# Altium schematic sheet Top.SchDoc: Digital fMUX Mezzanine - TOP
size 817 x 513 mm; Engineer: M.Dobbs, McGill U.; Revision: 4; PageSetup: Record=PageOptions|CenterHorizontal=True|CenterVertical=True|PrintScale=0.52|XCorrection=1.00|YCorrection=1.00|PrintKind=0|BorderSize=5000000|LeftOffset=0|BottomOffset=0|Orientation=2|PaperLength=1000|PaperWidth=1000|Scale=100|PaperSource=15|PrintQuality=1200|MediaType=1|DitherType=10|PaperKind=11 x 17|PrintScaleMode=1
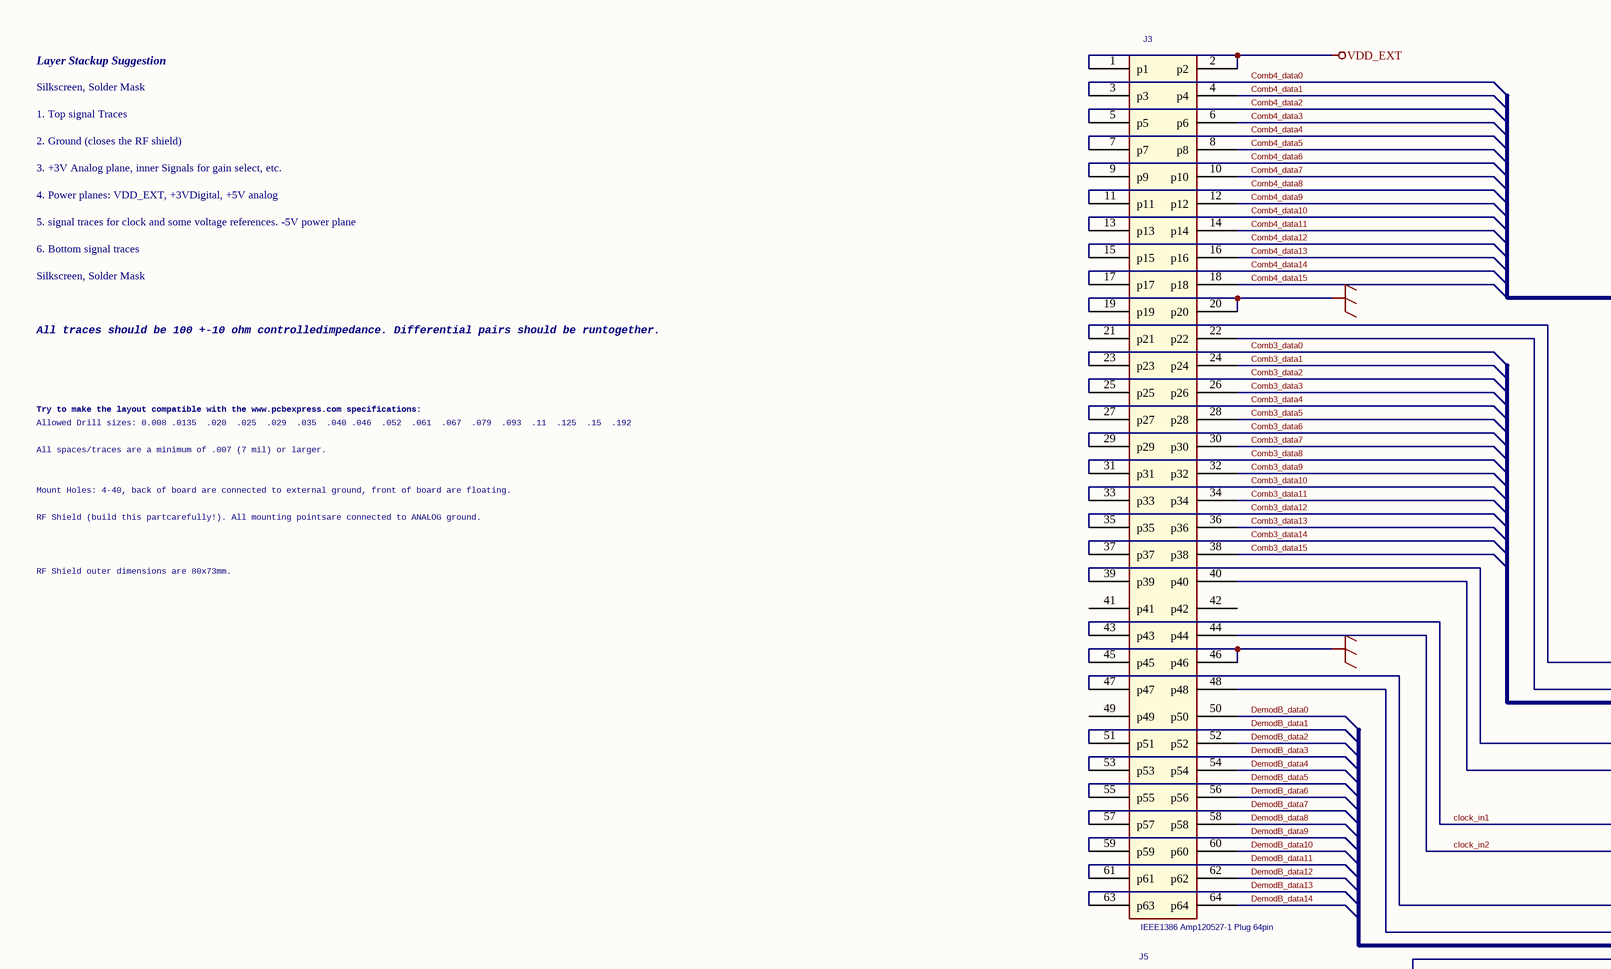
[diagram p0: Top.SchDoc, top left]
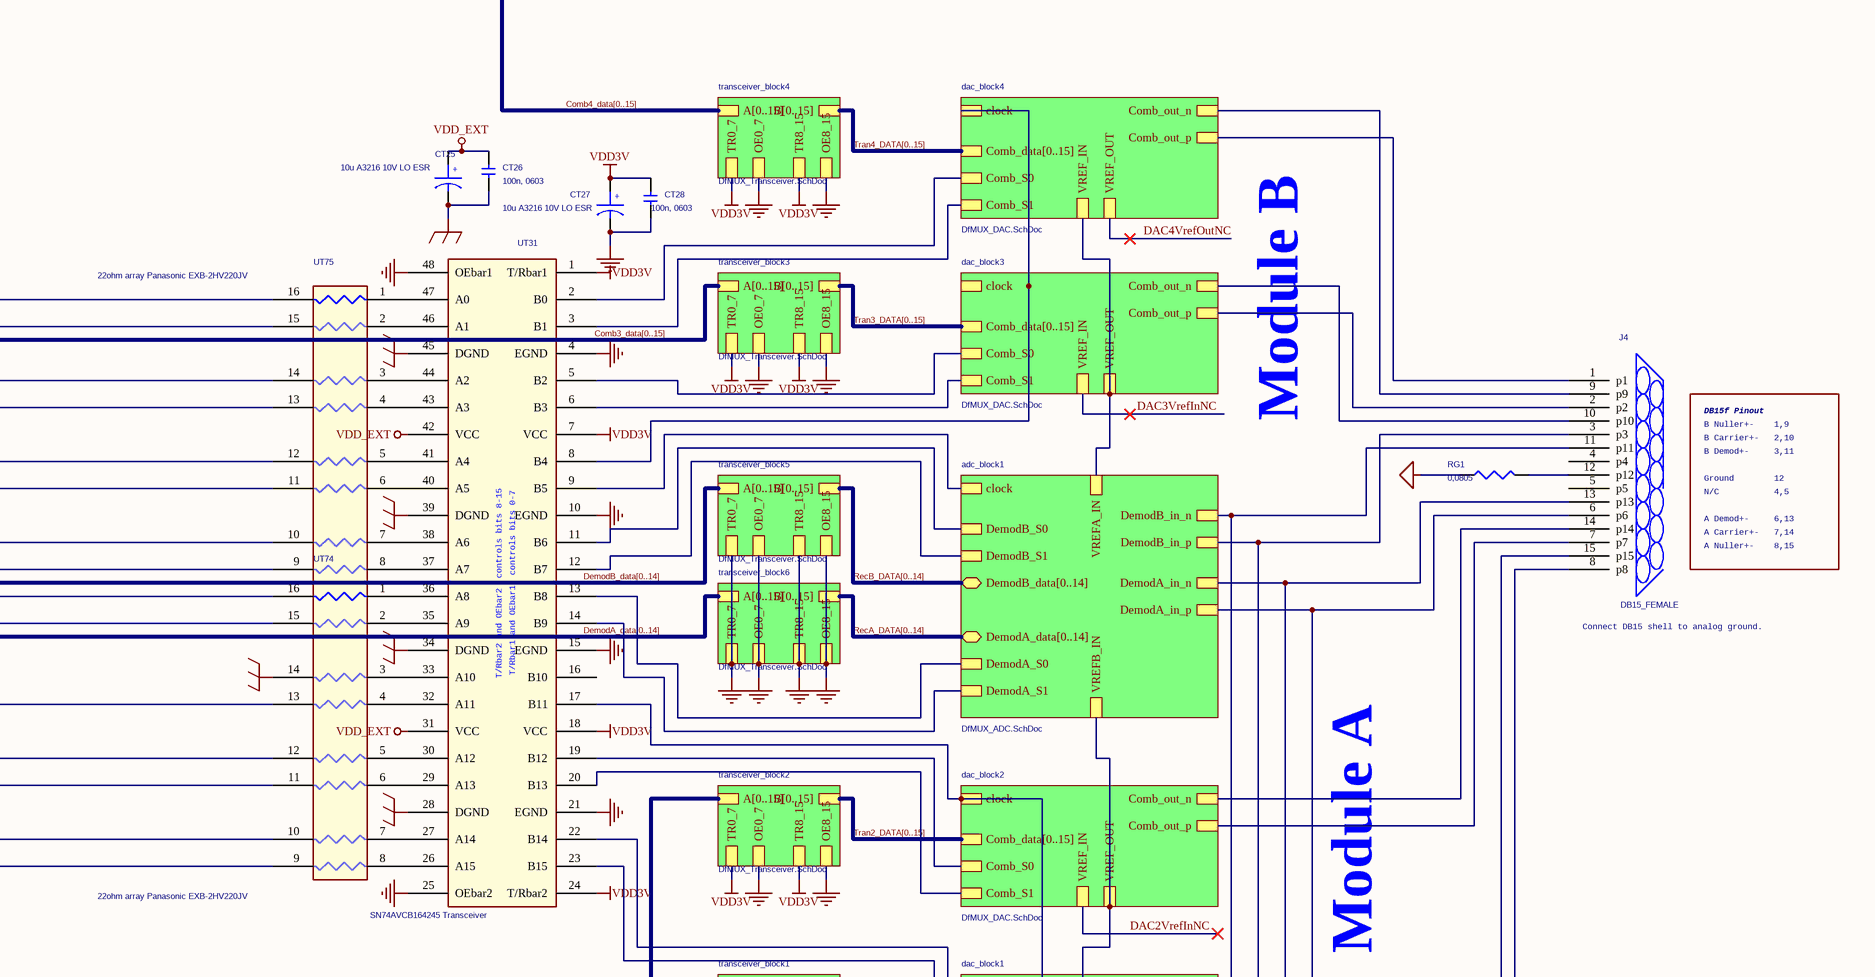
[diagram p1: Top.SchDoc, top right]
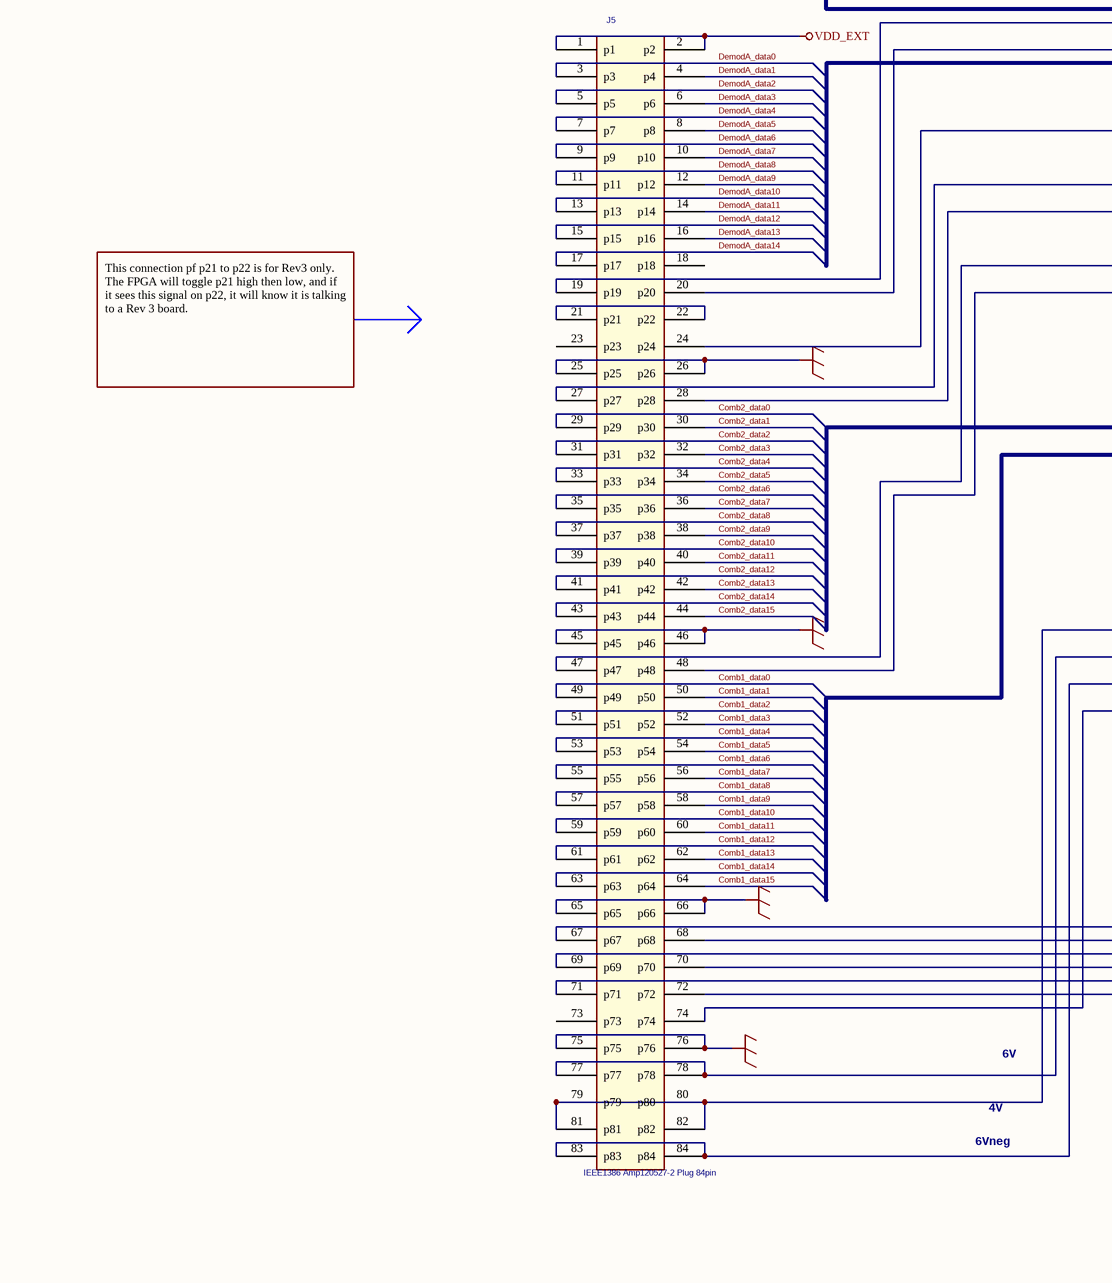
[diagram p2: Top.SchDoc, bottom left]
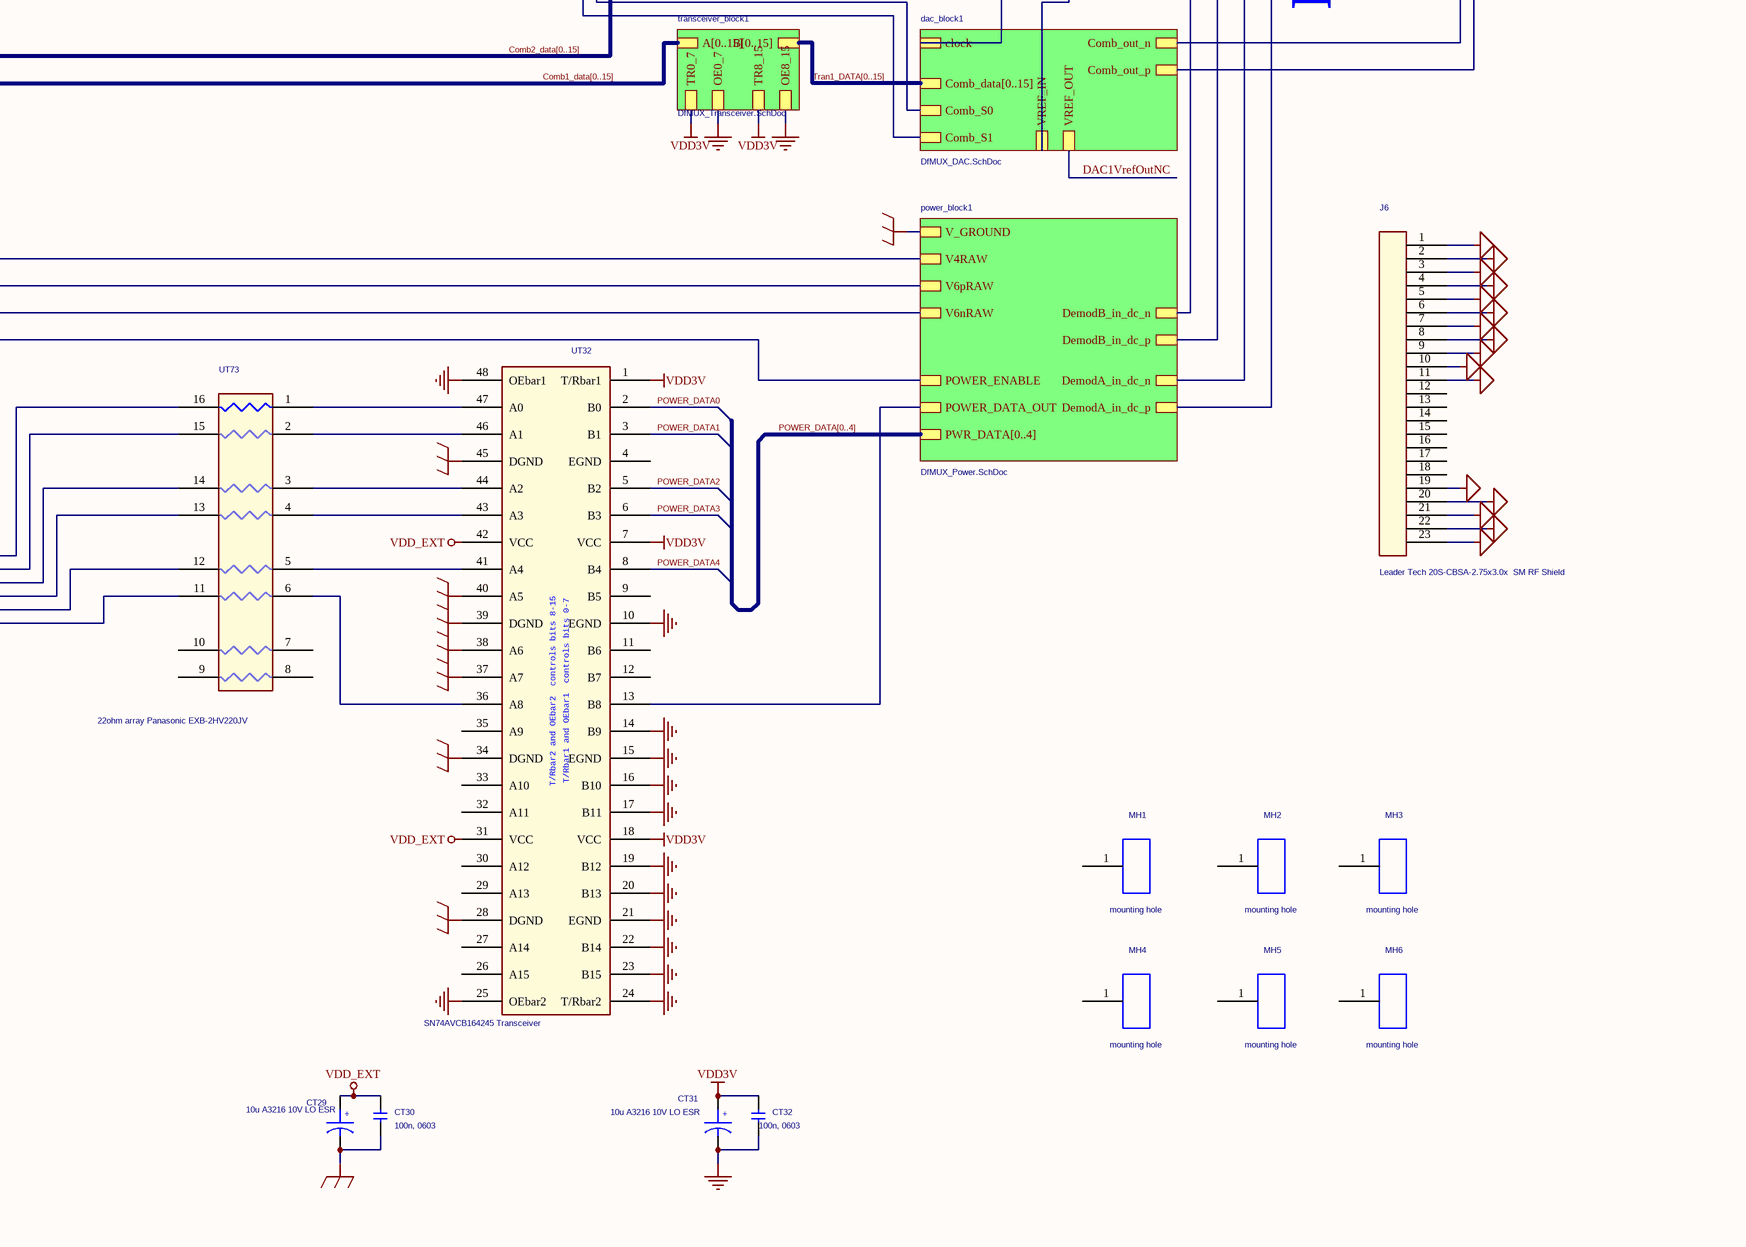
[diagram p3: Top.SchDoc, bottom right]

## Parts
CT25  10u A3216 10V LO ESR  [TANTA]
CT26  100n, 0603  [0603C]
CT27  10u A3216 10V LO ESR  [TANTA]
CT28  100n, 0603  [0603C]
CT29  10u A3216 10V LO ESR  [TANTA]
CT30  100n, 0603  [0603C]
CT31  10u A3216 10V LO ESR  [TANTA]
CT32  100n, 0603  [0603C]
J3  IEEE1386 Amp120527-1 Plug 64pin  [CON_AMP_1MM_64PINS]
J4  DB15_FEMALE  [DSUB/RS.318/TM/15]
J5  IEEE1386 Amp120527-2 Plug 84pin  [CON_AMP_1MM_84PINS]
J6  Leader Tech 20S-CBSA-2.75x3.0x  SM RF Shield  [SHIELD 2.75X3.00]
MH1  mounting hole  [MTHOLE.125]
MH2  mounting hole  [MTHOLE.125]
MH3  mounting hole  [MTHOLE.125]
MH4  mounting hole  [MTHOLE.125]
MH5  mounting hole  [MTHOLE.125]
MH6  mounting hole  [MTHOLE.125]
RG1  0,0805  [0805R]
UT31  SN74AVCB164245 Transceiver  [TSSOP48_.4MMPITCH_NARROW]
UT32  SN74AVCB164245 Transceiver  [TSSOP48_.4MMPITCH_NARROW]
UT73  22ohm array Panasonic EXB-2HV220JV  [RN8.150X63]
UT74  22ohm array Panasonic EXB-2HV220JV  [RN8.150X63]
UT75  22ohm array Panasonic EXB-2HV220JV  [RN8.150X63]

## Sub-sheets
adc_block1 = DfMUX_ADC.SchDoc: clock, DemodA_S0, DemodA_S1, DemodB_S0, DemodB_S1, DemodB_in_p, DemodB_in_n, DemodA_in_n, DemodA_in_p, VREFA_IN, VREFB_IN, DemodB_data[0..14], DemodA_data[0..14]
dac_block1 = DfMUX_DAC.SchDoc: Comb_data[0..15], Comb_S0, Comb_S1, Comb_out_p, Comb_out_n, clock, VREF_IN, VREF_OUT  | ReuseAnnotated: YES; Rd15_PartReference: RD17; Rd15_COMPLOC: [3002.633,445.433]; Rd30_PartReference: RD8; Rd30_COMPLOC: [3457.633,605.433]; Rd2set_PartReference: RD2SET1; Rd2set_COMPLOC: [2044.633,425.000]; Rd33_PartReference: RD15; Rd33_COMPLOC: [3002.633,500.433]; Cd9_PartReference: CD13; Cd9_COMPLOC: [2447.633,620.433]; Ld11_PartReference: LD1; Ld11_COMPLOC: [2202.633,700.433]; CD__PartReference: CD83; CD__COMPLOC: [3617.633,705.433]; Cd3_PartReference: CD9; Cd3_COMPLOC: [2087.633,640.433]; Rd36_PartReference: RD28; Rd36_COMPLOC: [2154.633,360.000]; Rd18_PartReference: RD4; Rd18_COMPLOC: [2947.633,610.433]; Rd38_PartReference: RD30; Rd38_COMPLOC: [2269.633,350.000]; Ud4_PartReference: UD3; Ud4_COMPLOC: [3517.633,435.433]; Rd29_PartReference: RD25; Rd29_COMPLOC: [3455.633,442.433]; Ud1_PartReference: UD1; Ud1_COMPLOC: [1689.033,701.833]; Ud3_PartReference: UD2; Ud3_COMPLOC: [3172.633,410.433]; Rd26_PartReference: RD7; Rd26_COMPLOC: [3102.633,555.433]; Cd14_PartReference: CD19; Cd14_COMPLOC: [2852.633,415.433]; Rd11_PartReference: RD16; Rd11_COMPLOC: [2392.633,565.433]; Cd10_PartReference: CD11; Cd10_COMPLOC: [2507.633,620.433]; Rd20_PartReference: RD2; Rd20_COMPLOC: [2947.633,665.433]; Jd1_PartReference: JD1; Jd1_COMPLOC: [2127.633,495.433]; Cd2_PartReference: CD8; Cd2_COMPLOC: [2032.633,640.433]; Rd13_PartReference: RD9; Rd13_COMPLOC: [2612.633,600.433]; Cd18_PartReference: CD5; Cd18_COMPLOC: [3402.633,605.433]; Rd24_PartReference: RD5; Rd24_COMPLOC: [3102.633,665.433]; Rd19_PartReference: RD22; Rd19_COMPLOC: [2947.633,390.433]; Cd8_PartReference: CD10; Cd8_COMPLOC: [2279.633,533.433]; Cd6_PartReference: CD3; Cd6_COMPLOC: [1877.633,700.433]; Cd__3_PartReference: CD92; Cd__3_COMPLOC: [3617.633,430.433]; Rd22_PartReference: RD21; Rd22_COMPLOC: [3047.633,445.433]; Rd34_PartReference: RD1; Rd34_COMPLOC: [3342.633,720.433]; Cd16_PartReference: CD1; Cd16_COMPLOC: [2732.633,700.433]; Rd35_PartReference: RD29; Rd35_COMPLOC: [3294.633,350.000]; Cd7_PartReference: CD4; Cd7_COMPLOC: [1797.633,635.367]; Cd4_PartReference: CD14; Cd4_COMPLOC: [1747.633,460.433]; Rd14_PartReference: RD19; Rd14_COMPLOC: [2612.633,505.433]; Rd32_PartReference: RD13; Rd32_COMPLOC: [3722.633,600.000]; Cd15_PartReference: CD2; Cd15_COMPLOC: [2532.633,700.433]; Rd31_PartReference: RD18; Rd31_COMPROT: 0; Rd31_COMPLOC: [3722.633,534.367]; Ld14_PartReference: LD4; Ld14_COMPLOC: [2467.633,505.433]; Rd21_PartReference: RD23; Rd21_COMPLOC: [3047.633,390.433]; Rd37_PartReference: RD20; Rd37_COMPLOC: [2151.633,417.000]; Ld12_PartReference: LD3; Ld12_COMPLOC: [2337.633,425.433]; Rd12_PartReference: RD14; Rd12_COMPLOC: [2567.633,620.433]; Rd33_1_PartReference: RD11; Rd33_1_COMPLOC: [2392.633,620.433]; Rd28_PartReference: RD3; Rd28_COMPLOC: [3402.633,660.433]; Rd27_PartReference: RD27; Rd27_COMPLOC: [3397.633,390.433]; Rd23_PartReference: RD24; Rd23_COMPLOC: [3046.633,500.433]; Ld13_PartReference: LD2; Ld13_COMPLOC: [2372.633,700.433]; Cd19_PartReference: CD6; Cd19_COMPLOC: [3159.633,720.000]; CD__1_PartReference: CD84; CD__1_COMPLOC: [3657.633,360.433]; Cd1_PartReference: CD17; Cd1_COMPLOC: [2057.633,378.000]; Rd16_PartReference: RD26; Rd16_COMPLOC: [2732.633,355.433]; Rd25_PartReference: RD6; Rd25_COMPLOC: [3102.633,610.433]; Rd17_PartReference: RD12; Rd17_COMPLOC: [2947.633,555.433]; Cd5_PartReference: CD15; Cd5_COMPLOC: [1892.633,530.433]; Cd13_PartReference: CD20; Cd13_COMPLOC: [2847.633,355.433]; Rd10_PartReference: RD10; Rd10_COMPLOC: [2337.633,510.433]; Ud2_PartReference: UD4; Ud2_COMPLOC: [2877.633,625.433]; Cd__2_PartReference: CD91; Cd__2_COMPLOC: [3454.633,650.000]; Cd17_PartReference: CD18; Cd17_COMPLOC: [3397.633,440.433]; TitleBlock_2_Page_Number: 4
dac_block2 = DfMUX_DAC.SchDoc: Comb_data[0..15], Comb_S0, Comb_S1, Comb_out_p, Comb_out_n, clock, VREF_IN, VREF_OUT  | ReuseAnnotated: YES; Rd15_PartReference: RD47; Rd15_COMPLOC: [3002.633,891.433]; Rd30_PartReference: RD38; Rd30_COMPLOC: [3457.633,1051.433]; Rd2set_PartReference: RD2SET2; Rd2set_COMPLOC: [2055.633,875.000]; Rd33_PartReference: RD45; Rd33_COMPLOC: [3002.633,946.433]; Cd9_PartReference: CD33; Cd9_COMPLOC: [2447.633,1066.433]; Ld11_PartReference: LD5; Ld11_COMPLOC: [2224.633,1140.000]; CD__PartReference: CD85; CD__COMPLOC: [3617.633,1151.433]; Cd3_PartReference: CD29; Cd3_COMPLOC: [2087.633,1086.433]; Rd36_PartReference: RD58; Rd36_COMPLOC: [2157.633,820.000]; Rd18_PartReference: RD34; Rd18_COMPLOC: [2947.633,1056.433]; Rd38_PartReference: RD60; Rd38_COMPLOC: [2292.633,806.433]; Ud4_PartReference: UD7; Ud4_COMPLOC: [3517.633,881.433]; Rd29_PartReference: RD55; Rd29_COMPLOC: [3455.633,888.433]; Ud1_PartReference: UD5; Ud1_COMPLOC: [1689.033,1147.833]; Ud3_PartReference: UD6; Ud3_COMPLOC: [3172.633,856.433]; Rd26_PartReference: RD37; Rd26_COMPLOC: [3102.633,1001.433]; Cd14_PartReference: CD39; Cd14_COMPLOC: [2852.633,861.433]; Rd11_PartReference: RD46; Rd11_COMPLOC: [2392.633,1011.433]; Cd10_PartReference: CD31; Cd10_COMPLOC: [2507.633,1066.433]; Rd20_PartReference: RD32; Rd20_COMPLOC: [2947.633,1111.433]; Jd1_PartReference: JD2; Jd1_COMPLOC: [2127.633,941.433]; Cd2_PartReference: CD28; Cd2_COMPLOC: [2032.633,1086.433]; Rd13_PartReference: RD39; Rd13_COMPLOC: [2612.633,1046.433]; Cd18_PartReference: CD25; Cd18_COMPLOC: [3402.633,1051.433]; Rd24_PartReference: RD35; Rd24_COMPLOC: [3102.633,1111.433]; Rd19_PartReference: RD52; Rd19_COMPLOC: [2947.633,836.433]; Cd8_PartReference: CD30; Cd8_COMPLOC: [2279.633,979.433]; Cd6_PartReference: CD23; Cd6_COMPLOC: [1877.633,1146.433]; Cd__3_PartReference: CD94; Cd__3_COMPLOC: [3617.633,876.433]; Rd22_PartReference: RD51; Rd22_COMPLOC: [3047.633,891.433]; Rd34_PartReference: RD31; Rd34_COMPLOC: [3342.633,1166.433]; Cd16_PartReference: CD21; Cd16_COMPLOC: [2732.633,1146.433]; Rd35_PartReference: RD59; Rd35_COMPLOC: [3292.633,796.433]; Cd7_PartReference: CD24; Cd7_COMPLOC: [1799.633,1080.000]; Cd4_PartReference: CD34; Cd4_COMPLOC: [1747.633,906.433]; Rd14_PartReference: RD49; Rd14_COMPLOC: [2612.633,951.433]; Rd32_PartReference: RD43; Rd32_COMPLOC: [3719.633,1036.367]; Cd15_PartReference: CD22; Cd15_COMPLOC: [2532.633,1146.433]; Rd31_PartReference: RD48; Rd31_COMPROT: 0; Rd31_COMPLOC: [3719.633,982.367]; Ld14_PartReference: LD8; Ld14_COMPLOC: [2467.633,951.433]; Rd21_PartReference: RD53; Rd21_COMPLOC: [3047.633,836.433]; Rd37_PartReference: RD50; Rd37_COMPLOC: [2158.633,875.000]; Ld12_PartReference: LD7; Ld12_COMPLOC: [2337.633,871.433]; Rd12_PartReference: RD44; Rd12_COMPLOC: [2567.633,1066.433]; Rd33_1_PartReference: RD41; Rd33_1_COMPLOC: [2392.633,1066.433]; Rd28_PartReference: RD33; Rd28_COMPLOC: [3402.633,1106.433]; Rd27_PartReference: RD57; Rd27_COMPLOC: [3397.633,836.433]; Rd23_PartReference: RD54; Rd23_COMPLOC: [3046.633,946.433]; Ld13_PartReference: LD6; Ld13_COMPLOC: [2369.633,1140.000]; Cd19_PartReference: CD26; Cd19_COMPLOC: [3159.633,1165.000]; CD__1_PartReference: CD86; CD__1_COMPLOC: [3657.633,806.433]; Cd1_PartReference: CD37; Cd1_COMPLOC: [2054.633,820.000]; Rd16_PartReference: RD56; Rd16_COMPLOC: [2732.633,801.433]; Rd25_PartReference: RD36; Rd25_COMPLOC: [3102.633,1056.433]; Rd17_PartReference: RD42; Rd17_COMPLOC: [2947.633,1001.433]; Cd5_PartReference: CD35; Cd5_COMPLOC: [1892.633,976.433]; Cd13_PartReference: CD40; Cd13_COMPLOC: [2847.633,801.433]; Rd10_PartReference: RD40; Rd10_COMPLOC: [2337.633,956.433]; Ud2_PartReference: UD8; Ud2_COMPLOC: [2874.633,1070.000]; Cd__2_PartReference: CD93; Cd__2_COMPLOC: [3454.633,1095.000]; Cd17_PartReference: CD38; Cd17_COMPLOC: [3397.633,886.433]; TitleBlock_2_Page_Number: 5
dac_block3 = DfMUX_DAC.SchDoc: Comb_data[0..15], Comb_S0, Comb_S1, Comb_out_p, Comb_out_n, clock, VREF_IN, VREF_OUT  | ReuseAnnotated: YES; Rd15_PartReference: RD77; Rd15_COMPLOC: [3007.633,2511.433]; Rd30_PartReference: RD68; Rd30_COMPLOC: [3462.633,2671.433]; Rd2set_PartReference: RD2SET3; Rd2set_COMPLOC: [2054.633,2493.000]; Rd33_PartReference: RD75; Rd33_COMPLOC: [3007.633,2566.433]; Cd9_PartReference: CD53; Cd9_COMPLOC: [2452.633,2686.433]; Ld11_PartReference: LD9; Ld11_COMPLOC: [2207.633,2766.433]; CD__PartReference: CD87; CD__COMPLOC: [3622.633,2771.433]; Cd3_PartReference: CD49; Cd3_COMPLOC: [2092.633,2706.433]; Rd36_PartReference: RD88; Rd36_COMPLOC: [2157.633,2434.000]; Rd18_PartReference: RD64; Rd18_COMPLOC: [2952.633,2676.433]; Rd38_PartReference: RD90; Rd38_COMPLOC: [2297.633,2426.433]; Ud4_PartReference: UD11; Ud4_COMPLOC: [3522.633,2501.433]; Rd29_PartReference: RD85; Rd29_COMPLOC: [3460.633,2508.433]; Ud1_PartReference: UD9; Ud1_COMPLOC: [1694.033,2767.833]; Ud3_PartReference: UD10; Ud3_COMPLOC: [3177.633,2476.433]; Rd26_PartReference: RD67; Rd26_COMPLOC: [3107.633,2621.433]; Cd14_PartReference: CD59; Cd14_COMPLOC: [2857.633,2481.433]; Rd11_PartReference: RD76; Rd11_COMPLOC: [2397.633,2631.433]; Cd10_PartReference: CD51; Cd10_COMPLOC: [2512.633,2686.433]; Rd20_PartReference: RD62; Rd20_COMPLOC: [2952.633,2731.433]; Jd1_PartReference: JD3; Jd1_COMPLOC: [2132.633,2561.433]; Cd2_PartReference: CD48; Cd2_COMPLOC: [2037.633,2706.433]; Rd13_PartReference: RD69; Rd13_COMPLOC: [2617.633,2666.433]; Cd18_PartReference: CD45; Cd18_COMPLOC: [3407.633,2671.433]; Rd24_PartReference: RD65; Rd24_COMPLOC: [3107.633,2731.433]; Rd19_PartReference: RD82; Rd19_COMPLOC: [2952.633,2456.433]; Cd8_PartReference: CD50; Cd8_COMPLOC: [2284.633,2599.433]; Cd6_PartReference: CD43; Cd6_COMPLOC: [1882.633,2766.433]; Cd__3_PartReference: CD96; Cd__3_COMPLOC: [3622.633,2496.433]; Rd22_PartReference: RD81; Rd22_COMPLOC: [3052.633,2511.433]; Rd34_PartReference: RD61; Rd34_COMPLOC: [3347.633,2786.433]; Cd16_PartReference: CD41; Cd16_COMPLOC: [2737.633,2766.433]; Rd35_PartReference: RD89; Rd35_COMPLOC: [3294.633,2415.000]; Cd7_PartReference: CD44; Cd7_COMPLOC: [1804.633,2700.000]; Cd4_PartReference: CD54; Cd4_COMPLOC: [1752.633,2526.433]; Rd14_PartReference: RD79; Rd14_COMPLOC: [2617.633,2571.433]; Rd32_PartReference: RD73; Rd32_COMPLOC: [3725.633,2662.000]; Cd15_PartReference: CD42; Cd15_COMPLOC: [2537.633,2766.433]; Rd31_PartReference: RD78; Rd31_COMPROT: 90; Rd31_COMPLOC: [3727.633,2471.433]; Ld14_PartReference: LD12; Ld14_COMPLOC: [2472.633,2571.433]; Rd21_PartReference: RD83; Rd21_COMPLOC: [3052.633,2456.433]; Rd37_PartReference: RD80; Rd37_COMPLOC: [2157.633,2493.000]; Ld12_PartReference: LD11; Ld12_COMPLOC: [2342.633,2491.433]; Rd12_PartReference: RD74; Rd12_COMPLOC: [2572.633,2686.433]; Rd33_1_PartReference: RD71; Rd33_1_COMPLOC: [2397.633,2686.433]; Rd28_PartReference: RD63; Rd28_COMPLOC: [3407.633,2726.433]; Rd27_PartReference: RD87; Rd27_COMPLOC: [3402.633,2456.433]; Rd23_PartReference: RD84; Rd23_COMPLOC: [3051.633,2566.433]; Ld13_PartReference: LD10; Ld13_COMPLOC: [2377.633,2766.433]; Cd19_PartReference: CD46; Cd19_COMPLOC: [3164.633,2785.000]; CD__1_PartReference: CD88; CD__1_COMPLOC: [3662.633,2426.433]; Cd1_PartReference: CD57; Cd1_COMPLOC: [2054.633,2435.000]; Rd16_PartReference: RD86; Rd16_COMPLOC: [2737.633,2421.433]; Rd25_PartReference: RD66; Rd25_COMPLOC: [3107.633,2676.433]; Rd17_PartReference: RD72; Rd17_COMPLOC: [2952.633,2621.433]; Cd5_PartReference: CD55; Cd5_COMPLOC: [1897.633,2596.433]; Cd13_PartReference: CD60; Cd13_COMPLOC: [2852.633,2421.433]; Rd10_PartReference: RD70; Rd10_COMPLOC: [2342.633,2576.433]; Ud2_PartReference: UD12; Ud2_COMPLOC: [2879.633,2690.000]; Cd__2_PartReference: CD95; Cd__2_COMPLOC: [3459.633,2715.000]; Cd17_PartReference: CD58; Cd17_COMPLOC: [3402.633,2506.433]; TitleBlock_2_Page_Number: 6
dac_block4 = DfMUX_DAC.SchDoc: Comb_data[0..15], Comb_S0, Comb_S1, Comb_out_p, Comb_out_n, clock, VREF_IN, VREF_OUT  | ReuseAnnotated: YES; Rd15_PartReference: RD107; Rd15_COMPLOC: [3012.633,2966.433]; Rd30_PartReference: RD98; Rd30_COMPLOC: [3467.633,3126.433]; Rd2set_PartReference: RD2SET4; Rd2set_COMPLOC: [2055.633,2956.000]; Rd33_PartReference: RD105; Rd33_COMPLOC: [3012.633,3021.433]; Cd9_PartReference: CD73; Cd9_COMPLOC: [2457.633,3141.433]; Ld11_PartReference: LD13; Ld11_COMPLOC: [2212.633,3221.433]; CD__PartReference: CD89; CD__COMPLOC: [3627.633,3226.433]; Cd3_PartReference: CD69; Cd3_COMPLOC: [2097.633,3161.433]; Rd36_PartReference: RD118; Rd36_COMPLOC: [2161.633,2901.000]; Rd18_PartReference: RD94; Rd18_COMPLOC: [2957.633,3131.433]; Rd38_PartReference: RD120; Rd38_COMPLOC: [2302.633,2881.433]; Ud4_PartReference: UD15; Ud4_COMPLOC: [3527.633,2956.433]; Rd29_PartReference: RD115; Rd29_COMPLOC: [3465.633,2963.433]; Ud1_PartReference: UD13; Ud1_COMPLOC: [1699.033,3222.833]; Ud3_PartReference: UD14; Ud3_COMPLOC: [3182.633,2931.433]; Rd26_PartReference: RD97; Rd26_COMPLOC: [3112.633,3076.433]; Cd14_PartReference: CD79; Cd14_COMPLOC: [2862.633,2936.433]; Rd11_PartReference: RD106; Rd11_COMPLOC: [2402.633,3086.433]; Cd10_PartReference: CD71; Cd10_COMPLOC: [2517.633,3141.433]; Rd20_PartReference: RD92; Rd20_COMPLOC: [2957.633,3186.433]; Jd1_PartReference: JD4; Jd1_COMPLOC: [2137.633,3016.433]; Cd2_PartReference: CD68; Cd2_COMPLOC: [2042.633,3161.433]; Rd13_PartReference: RD99; Rd13_COMPLOC: [2622.633,3121.433]; Cd18_PartReference: CD65; Cd18_COMPLOC: [3412.633,3126.433]; Rd24_PartReference: RD95; Rd24_COMPLOC: [3112.633,3186.433]; Rd19_PartReference: RD112; Rd19_COMPLOC: [2957.633,2911.433]; Cd8_PartReference: CD70; Cd8_COMPLOC: [2289.633,3054.433]; Cd6_PartReference: CD63; Cd6_COMPLOC: [1887.633,3221.433]; Cd__3_PartReference: CD98; Cd__3_COMPLOC: [3627.633,2951.433]; Rd22_PartReference: RD111; Rd22_COMPLOC: [3057.633,2966.433]; Rd34_PartReference: RD91; Rd34_COMPLOC: [3352.633,3241.433]; Cd16_PartReference: CD61; Cd16_COMPLOC: [2742.633,3221.433]; Rd35_PartReference: RD119; Rd35_COMPLOC: [3302.633,2871.433]; Cd7_PartReference: CD64; Cd7_COMPLOC: [1807.633,3156.367]; Cd4_PartReference: CD74; Cd4_COMPLOC: [1754.633,2985.000]; Rd14_PartReference: RD109; Rd14_COMPLOC: [2622.633,3026.433]; Rd32_PartReference: RD103; Rd32_COMPLOC: [3733.633,3106.000]; Cd15_PartReference: CD62; Cd15_COMPLOC: [2542.633,3221.433]; Rd31_PartReference: RD108; Rd31_COMPROT: 90; Rd31_COMPLOC: [3732.633,2926.433]; Ld14_PartReference: LD16; Ld14_COMPLOC: [2477.633,3026.433]; Rd21_PartReference: RD113; Rd21_COMPLOC: [3057.633,2911.433]; Rd37_PartReference: RD110; Rd37_COMPLOC: [2161.633,2956.000]; Ld12_PartReference: LD15; Ld12_COMPLOC: [2347.633,2946.433]; Rd12_PartReference: RD104; Rd12_COMPLOC: [2577.633,3141.433]; Rd33_1_PartReference: RD101; Rd33_1_COMPLOC: [2402.633,3141.433]; Rd28_PartReference: RD93; Rd28_COMPLOC: [3412.633,3181.433]; Rd27_PartReference: RD117; Rd27_COMPLOC: [3407.633,2911.433]; Rd23_PartReference: RD114; Rd23_COMPLOC: [3056.633,3021.433]; Ld13_PartReference: LD14; Ld13_COMPLOC: [2382.633,3221.433]; Cd19_PartReference: CD66; Cd19_COMPLOC: [3169.633,3240.000]; CD__1_PartReference: CD90; CD__1_COMPLOC: [3667.633,2881.433]; Cd1_PartReference: CD77; Cd1_COMPLOC: [2057.633,2901.000]; Rd16_PartReference: RD116; Rd16_COMPLOC: [2742.633,2876.433]; Rd25_PartReference: RD96; Rd25_COMPLOC: [3112.633,3131.433]; Rd17_PartReference: RD102; Rd17_COMPLOC: [2957.633,3076.433]; Cd5_PartReference: CD75; Cd5_COMPLOC: [1902.633,3051.433]; Cd13_PartReference: CD80; Cd13_COMPLOC: [2857.633,2876.433]; Rd10_PartReference: RD100; Rd10_COMPLOC: [2347.633,3031.433]; Ud2_PartReference: UD16; Ud2_COMPLOC: [2884.633,3145.000]; Cd__2_PartReference: CD97; Cd__2_COMPLOC: [3459.633,3170.000]; Cd17_PartReference: CD78; Cd17_COMPLOC: [3407.633,2961.433]; TitleBlock_2_Page_Number: 7
power_block1 = DfMUX_Power.SchDoc: V4RAW, V6pRAW, V6nRAW, V_GROUND, POWER_ENABLE, PWR_DATA[0..4], DemodA_in_dc_p, DemodB_in_dc_p, POWER_DATA_OUT, DemodB_in_dc_n, DemodA_in_dc_n
transceiver_block1 = DfMUX_Transceiver.SchDoc: B[0..15], A[0..15], TR0_7, TR8_15, OE0_7, OE8_15  | Ct3_PartReference: CT37; Ct3_COMPLOC: [1187.633,883.367]; t4_PartReference: CT38; t4_COMPLOC: [1174.633,637.367]; Ct1_PartReference: CT39; Ct1_COMPLOC: [968.633,893.367]; Ct2_PartReference: CT40; Ct2_COMPLOC: [933.633,691.367]; UT__1_PartReference: UT62; UT__1_COMPLOC: [784.633,679.367]; Ut1_PartReference: UT40; Ut1_COMPLOC: [1187.633,958.367]; UT__PartReference: UT61; UT__COMPLOC: [784.633,874.367]; TitleBlock_Page_Number: 9
transceiver_block2 = DfMUX_Transceiver.SchDoc: B[0..15], A[0..15], TR0_7, TR8_15, OE0_7, OE8_15  | Ct3_PartReference: CT49; Ct3_COMPLOC: [1189.633,1295.367]; t4_PartReference: CT50; t4_COMPLOC: [1176.633,1049.367]; Ct1_PartReference: CT51; Ct1_COMPLOC: [970.633,1305.367]; Ct2_PartReference: CT52; Ct2_COMPLOC: [935.633,1103.367]; UT__1_PartReference: UT64; UT__1_COMPLOC: [779.633,1089.367]; Ut1_PartReference: UT55; Ut1_COMPLOC: [1189.633,1370.367]; UT__PartReference: UT63; UT__COMPLOC: [779.633,1284.367]; TitleBlock_Page_Number: 10
transceiver_block3 = DfMUX_Transceiver.SchDoc: B[0..15], A[0..15], TR0_7, TR8_15, OE0_7, OE8_15  | Ct3_PartReference: CT41; Ct3_COMPLOC: [1189.633,2936.367]; t4_PartReference: CT42; t4_COMPLOC: [1176.633,2690.367]; Ct1_PartReference: CT43; Ct1_COMPLOC: [970.633,2946.367]; Ct2_PartReference: CT44; Ct2_COMPLOC: [935.633,2744.367]; UT__1_PartReference: UT66; UT__1_COMPLOC: [779.633,2734.367]; Ut1_PartReference: UT45; Ut1_COMPLOC: [1189.633,3011.367]; UT__PartReference: UT65; UT__COMPLOC: [779.633,2926.367]; TitleBlock_Page_Number: 11
transceiver_block4 = DfMUX_Transceiver.SchDoc: B[0..15], A[0..15], TR0_7, TR8_15, OE0_7, OE8_15  | Ct3_PartReference: CT53; Ct3_COMPLOC: [1188.633,3349.367]; t4_PartReference: CT54; t4_COMPLOC: [1175.633,3103.367]; Ct1_PartReference: CT55; Ct1_COMPLOC: [969.633,3359.367]; Ct2_PartReference: CT56; Ct2_COMPLOC: [934.633,3157.367]; UT__1_PartReference: UT68; UT__1_COMPLOC: [779.633,3144.367]; Ut1_PartReference: UT60; Ut1_COMPLOC: [1188.633,3424.367]; UT__PartReference: UT67; UT__COMPLOC: [779.633,3339.367]; TitleBlock_Page_Number: 12
transceiver_block5 = DfMUX_Transceiver.SchDoc: B[0..15], A[0..15], TR0_7, TR8_15, OE0_7, OE8_15  | Ct3_PartReference: CT45; Ct3_COMPLOC: [1188.633,2114.367]; t4_PartReference: CT46; t4_COMPLOC: [1175.633,1868.367]; Ct1_PartReference: CT47; Ct1_COMPLOC: [969.633,2124.367]; Ct2_PartReference: CT48; Ct2_COMPLOC: [934.633,1922.367]; UT__1_PartReference: UT70; UT__1_COMPLOC: [779.633,1909.367]; Ut1_PartReference: UT50; Ut1_COMPLOC: [1188.633,2189.367]; UT__PartReference: UT69; UT__COMPLOC: [779.633,2104.367]; TitleBlock_Page_Number: 13
transceiver_block6 = DfMUX_Transceiver.SchDoc: B[0..15], A[0..15], TR0_7, TR8_15, OE0_7, OE8_15  | Ct3_PartReference: CT33; Ct3_COMPLOC: [1188.633,1705.367]; t4_PartReference: CT34; t4_COMPLOC: [1175.633,1459.367]; Ct1_PartReference: CT35; Ct1_COMPLOC: [969.633,1715.367]; Ct2_PartReference: CT36; Ct2_COMPLOC: [934.633,1513.367]; UT__1_PartReference: UT72; UT__1_COMPLOC: [779.633,1499.367]; Ut1_PartReference: UT35; Ut1_COMPLOC: [1188.633,1780.367]; UT__PartReference: UT71; UT__COMPLOC: [779.633,1694.367]; TitleBlock_Page_Number: 14

## Nets
GND_DIG: CT27.2 CT28.1 CT31.2 CT32.1 UT31.4(EGND) UT31.10(EGND) UT31.15(EGND) UT31.21(EGND) UT31.25(OEbar2) UT31.48(OEbar1) UT32.10(EGND) UT32.14(B9) UT32.15(EGND) UT32.16(B10) UT32.17(B11) UT32.19(B12) UT32.20(B13) UT32.21(EGND) UT32.22(B14) UT32.23(B15) UT32.24(T/Rbar2) UT32.25(OEbar2) UT32.48(OEbar1) ; sheet transceiver_block2/OE0_7, sheet transceiver_block2/OE8_15, sheet transceiver_block3/OE0_7, sheet transceiver_block3/OE8_15, sheet transceiver_block6/TR0_7, sheet transceiver_block6/TR8_15, sheet transceiver_block6/OE0_7, sheet transceiver_block6/OE8_15, sheet transceiver_block1/OE0_7, sheet transceiver_block1/OE8_15, sheet transceiver_block5/TR0_7, sheet transceiver_block5/TR8_15, sheet transceiver_block5/OE0_7, sheet transceiver_block5/OE8_15, sheet transceiver_block4/OE0_7, sheet transceiver_block4/OE8_15
GND_EARTH: CT25.2 CT26.1 CT29.2 CT30.1 J3.19(p19) J3.20(p20) J3.45(p45) J3.46(p46) J5.25(p25) J5.26(p26) J5.45(p45) J5.46(p46) J5.65(p65) J5.66(p66) J5.75(p75) J5.76(p76) UT31.28(DGND) UT31.34(DGND) UT31.39(DGND) UT31.45(DGND) UT32.28(DGND) UT32.34(DGND) UT32.37(A7) UT32.38(A6) UT32.39(DGND) UT32.40(A5) UT32.45(DGND) UT74.14(R3) ; sheet power_block1/V_GROUND
GND_SIGNAL: J6.1 J6.2 J6.3 J6.4 J6.5 J6.6 J6.7 J6.8 J6.9 J6.10 J6.11 J6.19 J6.20 J6.21 J6.22 J6.23 RG1.1
VDD3V: CT27.1 CT28.2 CT31.1 CT32.2 UT31.1(T/Rbar1) UT31.7(VCC) UT31.18(VCC) UT31.24(T/Rbar2) UT32.1(T/Rbar1) UT32.7(VCC) UT32.18(VCC) ; sheet transceiver_block2/TR0_7, sheet transceiver_block2/TR8_15, sheet transceiver_block3/TR0_7, sheet transceiver_block3/TR8_15, sheet transceiver_block1/TR0_7, sheet transceiver_block1/TR8_15, sheet transceiver_block4/TR0_7, sheet transceiver_block4/TR8_15
VDD_EXT: CT25.1 CT26.2 CT29.1 CT30.2 J3.1(p1) J3.2(p2) J5.1(p1) J5.2(p2) UT31.31(VCC) UT31.42(VCC) UT32.31(VCC) UT32.42(VCC)
clock_in1: J3.43(p43) UT75.12(R5)
clock_in2: J3.44(p44) UT75.11(R6)
Comb1_data0: J5.49(p49)
Comb1_data1: J5.50(p50)
Comb1_data2: J5.51(p51)
Comb1_data3: J5.52(p52)
Comb1_data4: J5.53(p53)
Comb1_data5: J5.54(p54)
Comb1_data6: J5.55(p55)
Comb1_data7: J5.56(p56)
Comb1_data8: J5.57(p57)
Comb1_data9: J5.58(p58)
Comb1_data10: J5.59(p59)
Comb1_data11: J5.60(p60)
Comb1_data12: J5.61(p61)
Comb1_data13: J5.62(p62)
Comb1_data14: J5.63(p63)
Comb1_data15: J5.64(p64)
Comb2_data0: J5.29(p29)
Comb2_data1: J5.30(p30)
Comb2_data2: J5.31(p31)
Comb2_data3: J5.32(p32)
Comb2_data4: J5.33(p33)
Comb2_data5: J5.34(p34)
Comb2_data6: J5.35(p35)
Comb2_data7: J5.36(p36)
Comb2_data8: J5.37(p37)
Comb2_data9: J5.38(p38)
Comb2_data10: J5.39(p39)
Comb2_data11: J5.40(p40)
Comb2_data12: J5.41(p41)
Comb2_data13: J5.42(p42)
Comb2_data14: J5.43(p43)
Comb2_data15: J5.44(p44)
Comb3_data0: J3.23(p23)
Comb3_data1: J3.24(p24)
Comb3_data2: J3.25(p25)
Comb3_data3: J3.26(p26)
Comb3_data4: J3.27(p27)
Comb3_data5: J3.28(p28)
Comb3_data6: J3.29(p29)
Comb3_data7: J3.30(p30)
Comb3_data8: J3.31(p31)
Comb3_data9: J3.32(p32)
Comb3_data10: J3.33(p33)
Comb3_data11: J3.34(p34)
Comb3_data12: J3.35(p35)
Comb3_data13: J3.36(p36)
Comb3_data14: J3.37(p37)
Comb3_data15: J3.38(p38)
Comb4_data0: J3.3(p3)
Comb4_data1: J3.4(p4)
Comb4_data2: J3.5(p5)
Comb4_data3: J3.6(p6)
Comb4_data4: J3.7(p7)
Comb4_data5: J3.8(p8)
Comb4_data6: J3.9(p9)
Comb4_data7: J3.10(p10)
Comb4_data8: J3.11(p11)
Comb4_data9: J3.12(p12)
Comb4_data10: J3.13(p13)
Comb4_data11: J3.14(p14)
Comb4_data12: J3.15(p15)
Comb4_data13: J3.16(p16)
Comb4_data14: J3.17(p17)
Comb4_data15: J3.18(p18)
DAC1VrefOutNC: sheet dac_block1/VREF_OUT
DAC2VrefInNC: sheet dac_block2/VREF_IN
DAC3VrefInNC: sheet dac_block3/VREF_IN
DAC4VrefOutNC: sheet dac_block4/VREF_OUT
DemodA_data0: J5.3(p3)
DemodA_data1: J5.4(p4)
DemodA_data2: J5.5(p5)
DemodA_data3: J5.6(p6)
DemodA_data4: J5.7(p7)
DemodA_data5: J5.8(p8)
DemodA_data6: J5.9(p9)
DemodA_data7: J5.10(p10)
DemodA_data8: J5.11(p11)
DemodA_data9: J5.12(p12)
DemodA_data10: J5.13(p13)
DemodA_data11: J5.14(p14)
DemodA_data12: J5.15(p15)
DemodA_data13: J5.16(p16)
DemodA_data14: J5.17(p17)
DemodB_data0: J3.50(p50)
DemodB_data1: J3.51(p51)
DemodB_data2: J3.52(p52)
DemodB_data3: J3.53(p53)
DemodB_data4: J3.54(p54)
DemodB_data5: J3.55(p55)
DemodB_data6: J3.56(p56)
DemodB_data7: J3.57(p57)
DemodB_data8: J3.58(p58)
DemodB_data9: J3.59(p59)
DemodB_data10: J3.60(p60)
DemodB_data11: J3.61(p61)
DemodB_data12: J3.62(p62)
DemodB_data13: J3.63(p63)
DemodB_data14: J3.64(p64)
POWER_DATA0: UT32.2(B0)
POWER_DATA1: UT32.3(B1)
POWER_DATA2: UT32.5(B2)
POWER_DATA3: UT32.6(B3)
POWER_DATA4: UT32.8(B4)
NetJ3_21: J3.21(p21) UT75.16(R1)
NetJ3_22: J3.22(p22) UT75.15(R2)
NetJ3_39: J3.39(p39) UT75.14(R3)
NetJ3_40: J3.40(p40) UT75.13(R4)
NetJ3_47: J3.47(p47) UT75.10(R7)
NetJ3_48: J3.48(p48) UT75.9(R8)
NetJ4_1: J4.1(p1) ; sheet dac_block4/Comb_out_p
NetJ4_2: J4.2(p2) ; sheet dac_block3/Comb_out_p
NetJ4_3: J4.3(p3) ; sheet adc_block1/DemodB_in_p, sheet power_block1/DemodB_in_dc_p
NetJ4_6: J4.6(p6) ; sheet adc_block1/DemodA_in_p, sheet power_block1/DemodA_in_dc_p
NetJ4_7: J4.7(p7) ; sheet dac_block2/Comb_out_p
NetJ4_8: J4.8(p8) ; sheet dac_block1/Comb_out_p
NetJ4_9: J4.9(p9) ; sheet dac_block4/Comb_out_n
NetJ4_10: J4.10(p10) ; sheet dac_block3/Comb_out_n
NetJ4_11: J4.11(p11) ; sheet adc_block1/DemodB_in_n, sheet power_block1/DemodB_in_dc_n
NetJ4_12: J4.12(p12) RG1.2
NetJ4_13: J4.13(p13) ; sheet adc_block1/DemodA_in_n, sheet power_block1/DemodA_in_dc_n
NetJ4_14: J4.14(p14) ; sheet dac_block2/Comb_out_n
NetJ4_15: J4.15(p15) ; sheet dac_block1/Comb_out_n
NetJ5_19: J5.19(p19) UT74.16(R1)
NetJ5_20: J5.20(p20) UT74.15(R2)
NetJ5_21: J5.21(p21) J5.22(p22)
NetJ5_24: J5.24(p24) UT74.13(R4)
NetJ5_27: J5.27(p27) UT74.12(R5)
NetJ5_28: J5.28(p28) UT74.11(R6)
NetJ5_47: J5.47(p47) UT74.10(R7)
NetJ5_48: J5.48(p48) UT74.9(R8)
NetJ5_67: J5.67(p67) UT73.16(R1)
NetJ5_68: J5.68(p68) UT73.15(R2)
NetJ5_69: J5.69(p69) UT73.14(R3)
NetJ5_70: J5.70(p70) UT73.13(R4)
NetJ5_71: J5.71(p71) UT73.12(R5)
NetJ5_72: J5.72(p72) UT73.11(R6)
NetJ5_74: J5.74(p74) ; sheet power_block1/POWER_ENABLE
NetJ5_77: J5.77(p77) J5.78(p78) ; sheet power_block1/V6pRAW
NetJ5_79: J5.79(p79) J5.80(p80) J5.81(p81) J5.82(p82) ; sheet power_block1/V4RAW
NetJ5_83: J5.83(p83) J5.84(p84) ; sheet power_block1/V6nRAW
NetUT31_2: UT31.2(B0) ; sheet dac_block4/Comb_S0
NetUT31_3: UT31.3(B1) ; sheet dac_block4/Comb_S1
NetUT31_5: UT31.5(B2) ; sheet dac_block3/Comb_S0
NetUT31_6: UT31.6(B3) ; sheet dac_block3/Comb_S1
NetUT31_8: UT31.8(B4) ; sheet dac_block4/clock, sheet dac_block3/clock
NetUT31_9: UT31.9(B5) ; sheet adc_block1/clock
NetUT31_11: UT31.11(B6) ; sheet adc_block1/DemodB_S0
NetUT31_12: UT31.12(B7) ; sheet adc_block1/DemodB_S1
NetUT31_13: UT31.13(B8) ; sheet adc_block1/DemodA_S0
NetUT31_14: UT31.14(B9) ; sheet adc_block1/DemodA_S1
NetUT31_17: UT31.17(B11) ; sheet dac_block1/clock, sheet dac_block2/clock
NetUT31_19: UT31.19(B12) ; sheet dac_block2/Comb_S0
NetUT31_20: UT31.20(B13) ; sheet dac_block2/Comb_S1
NetUT31_22: UT31.22(B14) ; sheet dac_block1/Comb_S0
NetUT31_23: UT31.23(B15) ; sheet dac_block1/Comb_S1
NetUT31_26: UT31.26(A15) UT74.8(R8)
NetUT31_27: UT31.27(A14) UT74.7(R7)
NetUT31_29: UT31.29(A13) UT74.6(R6)
NetUT31_30: UT31.30(A12) UT74.5(R5)
NetUT31_32: UT31.32(A11) UT74.4(R4)
NetUT31_33: UT31.33(A10) UT74.3(R3)
NetUT31_35: UT31.35(A9) UT74.2(R2)
NetUT31_36: UT31.36(A8) UT74.1(R1)
NetUT31_37: UT31.37(A7) UT75.8(R8)
NetUT31_38: UT31.38(A6) UT75.7(R7)
NetUT31_40: UT31.40(A5) UT75.6(R6)
NetUT31_41: UT31.41(A4) UT75.5(R5)
NetUT31_43: UT31.43(A3) UT75.4(R4)
NetUT31_44: UT31.44(A2) UT75.3(R3)
NetUT31_46: UT31.46(A1) UT75.2(R2)
NetUT31_47: UT31.47(A0) UT75.1(R1)
NetUT32_13: UT32.13(B8) ; sheet power_block1/POWER_DATA_OUT
NetUT32_36: UT32.36(A8) UT73.6(R6)
NetUT32_41: UT32.41(A4) UT73.5(R5)
NetUT32_43: UT32.43(A3) UT73.4(R4)
NetUT32_44: UT32.44(A2) UT73.3(R3)
NetUT32_46: UT32.46(A1) UT73.2(R2)
NetUT32_47: UT32.47(A0) UT73.1(R1)
(unnamed): sheet dac_block1/VREF_IN, sheet adc_block1/VREFB_IN, sheet dac_block2/VREF_OUT
(unnamed): sheet dac_block4/VREF_IN, sheet adc_block1/VREFA_IN, sheet dac_block3/VREF_OUT

Not connected (* = marked no-connect by the designer): J3 41(p41) 42(p42) 49(p49); J4 4(p4) 5(p5); J5 18(p18) 23(p23) 73(p73); J6 12 13 14 15 16 17 18; MH1 1(A); MH2 1(A); MH3 1(A); MH4 1(A); MH5 1(A); MH6 1(A); UT31 16(B10); UT32 4(EGND) 9(B5) 11(B6) 12(B7) 26(A15) 27(A14) 29(A13) 30(A12) 32(A11) 33(A10) 35(A9); UT73 7(R7) 8(R8) 9(R8) 10(R7)

## Buses and harness runs
bus Comb1_data[0..15] = sheet transceiver_block1/A[0..15]
bus Comb2_data[0..15] = sheet transceiver_block2/A[0..15]
bus Comb3_data[0..15] = sheet transceiver_block3/A[0..15]
bus Comb4_data[0..15] = sheet transceiver_block4/A[0..15]
bus DemodA_data[0..14] = sheet transceiver_block6/A[0..15]
bus DemodB_data[0..14] = sheet transceiver_block5/A[0..15]
bus POWER_DATA[0..4] = sheet power_block1/PWR_DATA[0..4]
bus RecA_DATA[0..14] = sheet adc_block1/DemodA_data[0..14] = sheet transceiver_block6/B[0..15]
bus RecB_DATA[0..14] = sheet adc_block1/DemodB_data[0..14] = sheet transceiver_block5/B[0..15]
bus Tran1_DATA[0..15] = sheet dac_block1/Comb_data[0..15] = sheet transceiver_block1/B[0..15]
bus Tran2_DATA[0..15] = sheet dac_block2/Comb_data[0..15] = sheet transceiver_block2/B[0..15]
bus Tran3_DATA[0..15] = sheet dac_block3/Comb_data[0..15] = sheet transceiver_block3/B[0..15]
bus Tran4_DATA[0..15] = sheet dac_block4/Comb_data[0..15] = sheet transceiver_block4/B[0..15]

## Notes on the sheet
- Layer Stackup Suggestion
- Silkscreen, Solder Mask
- 1. Top signal Traces
- 2. Ground (closes the RF shield)
- 3. +3V Analog plane, inner Signals for gain select, etc.
- 4. Power planes: VDD_EXT, +3VDigital, +5V analog
- 5. signal traces for clock and some voltage references. -5V power plane
- 6. Bottom signal traces
- All traces should be 100 +-10 ohm controlledimpedance. Differential pairs should be runtogether.
- Try to make the layout compatible with the www.pcbexpress.com specifications:
- Allowed Drill sizes: 0.008 .0135  .020  .025  .029  .035  .040 .046  .052  .061  .067  .079  .093  .11  .125  .15  .192
- Mount Holes: 4-40, back of board are connected to external ground, front of board are floating.
- All spaces/traces are a minimum of .007 (7 mil) or larger.
- RF Shield (build this partcarefully!). All mounting pointsare connected to ANALOG ground.
- RF Shield outer dimensions are 80x73mm.
- Module B
- DB15f Pinout
- B Nuller+-    1,9
- B Carrier+-   2,10
- B Demod+-     3,11
- Ground        12
- N/C           4,5
- A Carrier+-   7,14
- A Demod+-     6,13
- A Nuller+-    8,15
- Connect DB15 shell to analog ground.
- This connection pf p21 to p22 is for Rev3 only. The FPGA will toggle p21 high then low, and if it sees this signal on p22, it will know it is talking to a Rev 3 board.
- Module A
- 4V
- 6V
- 6Vneg
- (in symbol 74LVT16245 Transceiver_0) T/Rbar2 and OEbar2  controls bits 8-15; T/Rbar1 and OEbar1  controls bits 0-7
- (in symbol CAPACITOR POL) +

## Library data of the parts
CT25 = CAPACITOR POL: COMPFIXED: NO; COMPGROUP: 0; COMPHEIGHT: 0.000; COMPLOC: [969.633,2534.367]; COMPROT: 270; COMPSIDE: TOP; COMPKEY: NO; COMPLOCKED: NO; DECOUPLER: NO; MEMORY: NO
CT26 = C: PSpiceTemplate: C^@REFDES %1 %2 ?TOLERANCE|C^@REFDES| @VALUE ?IC/IC=@IC/ ?TOLERANCE|\n.model C^@REFDES CAP C=1 DEV=@TOLERANCE%|; COMPFIXED: NO; COMPGROUP: 0; COMPHEIGHT: 0.000; COMPLOC: [934.633,2329.367]; COMPSIDE: TOP; Value: 100n, 0603; COMPKEY: NO; COMPLOCKED: NO; COMPROT: 0; DECOUPLER: NO; MEMORY: NO
CT27 = CAPACITOR POL: COMPFIXED: NO; COMPGROUP: 0; COMPHEIGHT: 0.000; COMPLOC: [1189.633,2524.367]; COMPROT: 270; COMPSIDE: TOP; COMPKEY: NO; COMPLOCKED: NO; DECOUPLER: NO; MEMORY: NO
CT28 = C: PSpiceTemplate: C^@REFDES %1 %2 ?TOLERANCE|C^@REFDES| @VALUE ?IC/IC=@IC/ ?TOLERANCE|\n.model C^@REFDES CAP C=1 DEV=@TOLERANCE%|; COMPFIXED: NO; COMPGROUP: 0; COMPHEIGHT: 0.000; COMPLOC: [1174.633,2279.367]; COMPROT: 90; COMPSIDE: TOP; Value: 100n, 0603; COMPKEY: NO; COMPLOCKED: NO; DECOUPLER: NO; MEMORY: NO
CT29 = CAPACITOR POL: COMPFIXED: NO; COMPGROUP: 0; COMPHEIGHT: 0.000; COMPLOC: [969.633,484.367]; COMPROT: 270; COMPSIDE: TOP; COMPKEY: NO; COMPLOCKED: NO; DECOUPLER: NO; MEMORY: NO
CT30 = C: PSpiceTemplate: C^@REFDES %1 %2 ?TOLERANCE|C^@REFDES| @VALUE ?IC/IC=@IC/ ?TOLERANCE|\n.model C^@REFDES CAP C=1 DEV=@TOLERANCE%|; COMPFIXED: NO; COMPGROUP: 0; COMPHEIGHT: 0.000; COMPLOC: [939.633,284.367]; COMPSIDE: TOP; Value: 100n, 0603; COMPKEY: NO; COMPLOCKED: NO; COMPROT: 0; DECOUPLER: NO; MEMORY: NO
CT31 = CAPACITOR POL: COMPFIXED: NO; COMPGROUP: 0; COMPHEIGHT: 0.000; COMPLOC: [1189.633,469.367]; COMPROT: 270; COMPSIDE: TOP; COMPKEY: NO; COMPLOCKED: NO; DECOUPLER: NO; MEMORY: NO
CT32 = C: PSpiceTemplate: C^@REFDES %1 %2 ?TOLERANCE|C^@REFDES| @VALUE ?IC/IC=@IC/ ?TOLERANCE|\n.model C^@REFDES CAP C=1 DEV=@TOLERANCE%|; COMPFIXED: NO; COMPGROUP: 0; COMPHEIGHT: 0.000; COMPLOC: [1174.633,228.367]; COMPROT: 90; COMPSIDE: TOP; Value: 100n, 0603; COMPKEY: NO; COMPLOCKED: NO; DECOUPLER: NO; MEMORY: NO
J3 = IEEE1386 Amp120527-1 Plug 64pin: COMPFIXED: NO; COMPGROUP: 0; COMPHEIGHT: 0.000; COMPLOC: [194.633,3349.433]; COMPROT: 90; COMPSIDE: TOP; COMPKEY: NO; COMPLOCKED: NO; DECOUPLER: NO; MEMORY: NO
J4 = DB15_FEMALE: COMPFIXED: NO; COMPGROUP: 0; COMPHEIGHT: 0.000; COMPLOC: [4502.733,1338.467]; COMPROT: 270; COMPSIDE: TOP; COMPKEY: NO; COMPLOCKED: NO; DECOUPLER: NO; MEMORY: NO
J5 = IEEE1386 Amp120527-2 Plug84pin: COMPFIXED: NO; COMPGROUP: 0; COMPHEIGHT: 0.000; COMPLOC: [194.633,1904.367]; COMPROT: 90; COMPSIDE: TOP; COMPKEY: NO; COMPLOCKED: NO; DECOUPLER: NO; MEMORY: NO
J6 = CONN FLEX 23: COMPROT: 270; COMPLOC: [4237.633,3305.000]; COMPFIXED: NO; COMPGROUP: 0; COMPHEIGHT: 0.000; COMPSIDE: TOP; COMPKEY: NO; COMPLOCKED: NO; DECOUPLER: NO; MEMORY: NO
MH1 = SOUNDER_0: COMPFIXED: NO; COMPGROUP: 0; COMPHEIGHT: 0.000; COMPLOC: [254.633,3525.000]; COMPSIDE: TOP; COMPKEY: NO; COMPLOCKED: NO; COMPROT: 0; DECOUPLER: NO; MEMORY: NO
MH2 = SOUNDER_0: COMPFIXED: NO; COMPGROUP: 0; COMPHEIGHT: 0.000; COMPLOC: [254.633,100.000]; COMPSIDE: TOP; COMPKEY: NO; COMPLOCKED: NO; COMPROT: 0; DECOUPLER: NO; MEMORY: NO
MH3 = SOUNDER_0: COMPFIXED: NO; COMPGROUP: 0; COMPHEIGHT: 0.000; COMPLOC: [4254.633,100.000]; COMPSIDE: TOP; COMPKEY: NO; COMPLOCKED: NO; COMPROT: 0; DECOUPLER: NO; MEMORY: NO
MH4 = SOUNDER_0: COMPFIXED: NO; COMPGROUP: 0; COMPHEIGHT: 0.000; COMPLOC: [4254.633,3525.000]; COMPSIDE: TOP; COMPKEY: NO; COMPLOCKED: NO; COMPROT: 0; DECOUPLER: NO; MEMORY: NO
MH5 = SOUNDER_0: COMPFIXED: NO; COMPGROUP: 0; COMPHEIGHT: 0.000; COMPLOC: [2579.633,3525.000]; COMPSIDE: TOP; COMPKEY: NO; COMPLOCKED: NO; COMPROT: 0; DECOUPLER: NO; MEMORY: NO
MH6 = SOUNDER_0: COMPFIXED: NO; COMPGROUP: 0; COMPHEIGHT: 0.000; COMPLOC: [3179.633,100.000]; COMPSIDE: TOP; COMPKEY: NO; COMPLOCKED: NO; COMPROT: 0; DECOUPLER: NO; MEMORY: NO
RG1 = R
UT31 = 74LVT16245 Transceiver_0: COMPFIXED: NO; COMPGROUP: 0; COMPHEIGHT: 0.000; COMPLOC: [1188.633,2599.367]; COMPROT: 90; COMPSIDE: BOT; FPLIST: TSSOP48_.4MMPITCH,TSSOP48_.4MMPITCH_NARROW; COMPKEY: NO; COMPLOCKED: NO; DECOUPLER: NO; MEMORY: NO
UT32 = 74LVT16245 Transceiver_0: COMPFIXED: NO; COMPGROUP: 0; COMPHEIGHT: 0.000; COMPLOC: [1189.633,549.367]; COMPROT: 90; COMPSIDE: BOT; FPLIST: TSSOP48_.4MMPITCH,TSSOP48_.4MMPITCH_NARROW; COMPKEY: NO; COMPLOCKED: NO; DECOUPLER: NO; MEMORY: NO
UT73 = R-PACK_1: COMPFIXED: NO; COMPGROUP: 0; COMPHEIGHT: 0.000; COMPLOC: [783.633,464.367]; COMPROT: 90; COMPSIDE: BOT; COMPKEY: NO; COMPLOCKED: NO; DECOUPLER: NO; MEMORY: NO
UT74 = R-PACK_1: COMPFIXED: NO; COMPGROUP: 0; COMPHEIGHT: 0.000; COMPLOC: [779.633,2322.367]; COMPROT: 90; COMPSIDE: BOT; COMPKEY: NO; COMPLOCKED: NO; DECOUPLER: NO; MEMORY: NO
UT75 = R-PACK_1: COMPFIXED: NO; COMPGROUP: 0; COMPHEIGHT: 0.000; COMPLOC: [779.633,2514.367]; COMPROT: 90; COMPSIDE: BOT; COMPKEY: NO; COMPLOCKED: NO; DECOUPLER: NO; MEMORY: NO